# EAGLE schematic circuit_diagram (EAGLE 8.7.1)
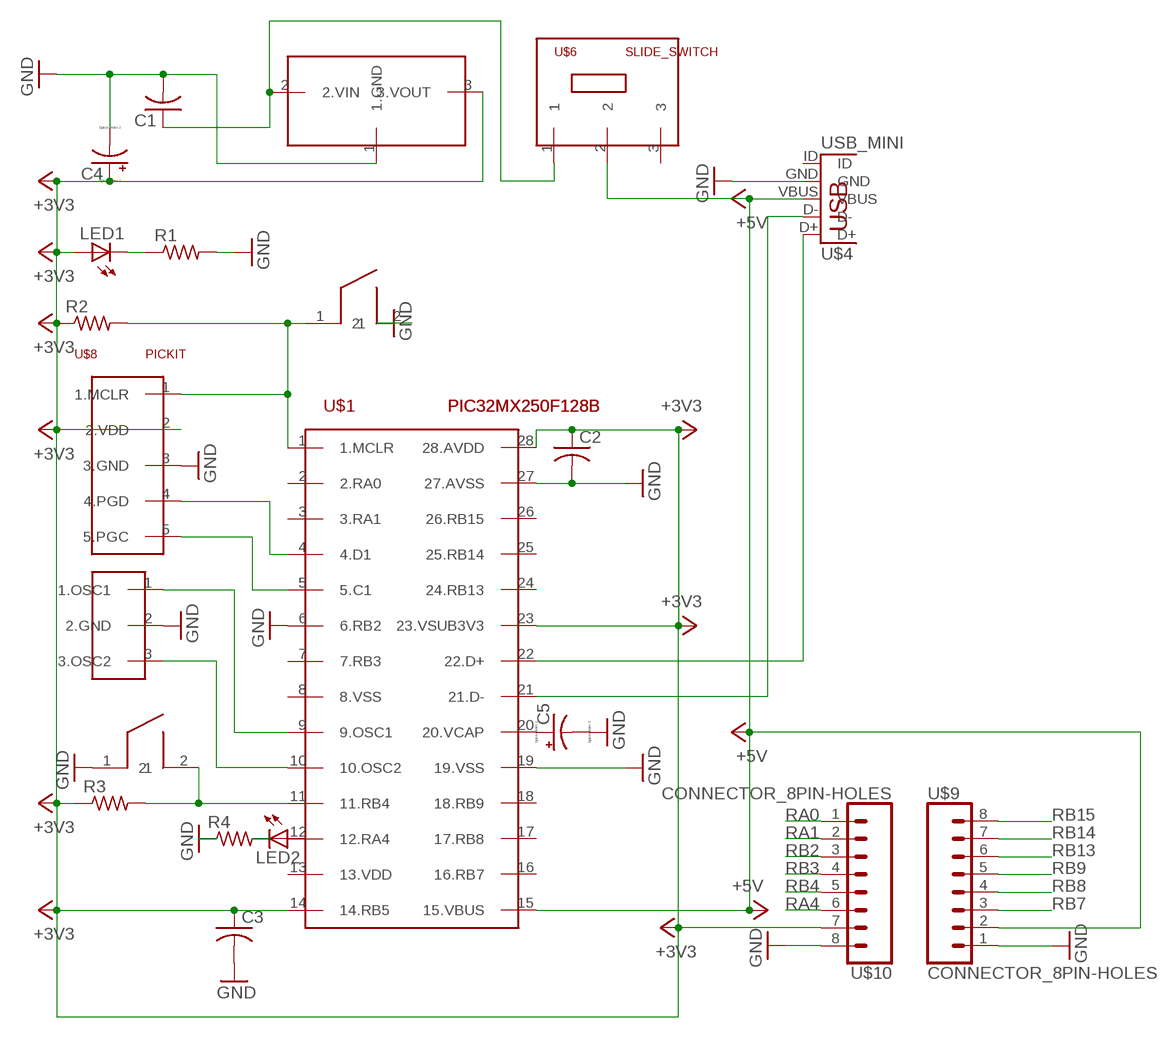
[diagram p0: schematic, sheet 1]

## Parts
C1  C-US025-024X044  [C025-024X044]
C2  C-US025-024X044  [C025-024X044]
C3  C-US025-024X044  [C025-024X044]
C4  CPOL-USCT3216  [CT3216]
C5  CPOL-USCT3216  [CT3216]
LED1  LED3MM  [LED3MM]
LED2  LED3MM  [LED3MM]
R1  R-US_0207/10  [0207/10]
R2  R-US_0207/10  [0207/10]
R3  R-US_0207/10  [0207/10]
R4  R-US_0207/10  [0207/10]
U$1  PIC32MX250F128B  [DIL28-3]
U$2  PUSH_BUTTON_SPST-NO  [1X03]
U$3  PUSH_BUTTON_SPST-NO  [1X03]
U$4  USB_MINI  [USB-MB-H]
U$5  MCP1072  [TO92]
U$6  SLIDE_SWITCH  [SLIDE_SW]
U$7  OSC  [1X03]
U$8  PICKIT  [1X05]
U$9  CONNECTOR_8PIN-HOLES  [1X08]
U$10  CONNECTOR_8PIN-HOLES  [1X08]

## Nets
+3V3: C2.1 C3.1 C4.-(+) LED1.A R2.1 R3.1 U$1.14(14.RB5) U$1.23(23.VSUB3V3) U$1.28(28.AVDD) U$5.3(3.VOUT) U$8.2(2.VDD) U$10.7
+5V: U$1.15(15.VBUS) U$4.VBUS U$6.2 U$9.2
GND: C1.2 C2.2 C3.2 C4.+(-) C5.+(-) R1.2 R4.1 U$1.6(6.RB2) U$1.19(19.VSS) U$1.27(27.AVSS) U$2.2 U$3.1 U$4.GND U$5.1(1.GND) U$7.2(2.GND) U$8.3(3.GND) U$9.1 U$10.8
N$1: LED1.K(C) R1.1
N$2: LED2.K(C) R4.2
N$3: R2.2 U$1.1(1.MCLR) U$2.1 U$8.1(1.MCLR)
N$4: C5.-(+) U$1.20(20.VCAP)
N$5: R3.2 U$1.11(11.RB4) U$3.2
N$6: U$1.22(22.D+) U$4.D+
N$7: U$1.21(21.D-) U$4.D-
N$8: C1.1 U$5.2(2.VIN) U$6.1
N$9: U$1.9(9.OSC1) U$7.1(1.OSC1)
N$10: U$1.10(10.OSC2) U$7.3(3.OSC2)
N$11: U$1.5(5.C1) U$8.5(5.PGC)
N$12: U$1.4(4.D1) U$8.4(4.PGD)
RA0: U$10.1
RA1: U$10.2
RA4: U$10.6
RB2: U$10.3
RB3: U$10.4
RB4: U$10.5
RB7: U$9.3
RB8: U$9.4
RB9: U$9.5
RB13: U$9.6
RB14: U$9.7
RB15: U$9.8
Unconnected: LED2.A U$1.2(2.RA0) U$1.3(3.RA1) U$1.7(7.RB3) U$1.8(8.VSS) U$1.12(12.RA4) U$1.13(13.VDD) U$1.16(16.RB7) U$1.17(17.RB8) U$1.18(18.RB9) U$1.24(24.RB13) U$1.25(25.RB14) U$1.26(26.RB15) U$4.ID U$6.3

## Library data of the parts
C1-C3 = resistor:C-US: CAPACITOR, American symbol
C4 C5 = resistor:CPOL-US: POLARIZED CAPACITOR, American symbol
LED1 LED2 = led:LED: LED OSRAM: - CHIPLED LG R971, LG N971, LY N971, LG Q971, LY Q971, LO R971, LY R971 LH N974, LH R974 LS Q976, LO Q976, LY Q976 LO Q996 - Hyper CHIPLED LW Q18S LB Q993, LB Q99A, LB R99A - SideLED LS A670, LO A670, LY A670, LG A670, LP A670 LB A673, LV A673, LT A673, LW A673 LH A674 LY A675 LS A676, LA A676, LO A676, LY A676, LW A676 LS A679, LY A679, LG A679 - Hyper Micro SIDELED® LS Y876, LA Y876, LO Y876, LY Y876 LT Y87S - SmartLED LW L88C, LW L88S LB L89C, LB L89S, LG L890 LS L89K, LO L89K, LY L89K LS L896, LA L896, LO L896, LY L896 - TOPLED LS T670, LO T670, LY T670, LG T670, LP T670 LSG T670, LSP T670, LSY T670, LOP T670, LYG T670 LG T671, LOG T671, LSG T671 LB T673, LV T673, LT T673, LW T673 LH T674 LS T676, LA T676, LO T676, LY T676, LB T676, LH T676, LSB T676, LW T676 LB T67C, LV T67C, LT T67C, LS T67K, LO T67K, LY T67K, LW E67C LS E67B, LA E67B, LO E67B, LY E67B, LB E67C, LV E67C, LT E67C LW T67C LS T679, LY T679, LG T679 LS T770, LO T770, LY T770, LG T770, LP T770 LB T773, LV T773, LT T773, LW T773 LH T774 LS E675, LA E675, LY E675, LS T675 LS T776, LA T776, LO T776, LY T776, LB T776 LHGB T686 LT T68C, LB T68C - Hyper Mini TOPLED® LB M676 - Mini TOPLED Santana® LG M470 LS M47K, LO M47K, LY M47K Source: http://www.osram.convergy.de LUXEON: - LUMILED® LXK2-PW12-R00, LXK2-PW12-S00, LXK2-PW14-U00, LXK2-PW14-V00 LXK2-PM12-R00, LXK2-PM12-S00, LXK2-PM14-U00 LXK2-PE12-Q00, LXK2-PE12-R00, LXK2-PE12-S00, LXK2-PE14-T00, LXK2-PE14-U00 LXK2-PB12-K00, LXK2-PB12-L00, LXK2-PB12-M00, LXK2-PB14-N00, LXK2-PB14-P00, LXK2-PB14-Q00 LXK2-PR12-L00, LXK2-PR12-M00, LXK2-PR14-Q00, LXK2-PR14-R00 LXK2-PD12-Q00, LXK2-PD12-R00, LXK2-PD12-S00 LXK2-PH12-R00, LXK2-PH12-S00 LXK2-PL12-P00, LXK2-PL12-Q00, LXK2-PL12-R00 Source: www.luxeon.com KINGBRIGHT: KA-3528ASYC Source: www.kingbright.com
R1-R4 = resistor:R-US_: RESISTOR, American symbol
U$1 = PIC32MX250F128B:PIC32MX250F128B
U$2 U$3 = PUSH_BUTTON:PUSH_BUTTON_SPST-NO
U$4 = usb_conn:USB_MINI
U$5 = V_REG:MCP1072
U$6 = SLIDE_SWITCH:SLIDE_SWITCH
U$7 = OSC:OSC
U$8 = pickit:PICKIT
U$9 U$10 = connectior-8pin-holes:CONNECTOR_8PIN-HOLES